# EasyEDA schematic Sheet_1.json
TITLE: IoT Counter; REV: 1.0; Date: 2021-06-05; Sheet: 1/1; Drawn By: usman.ashraf678; Company: Manna and Chopra
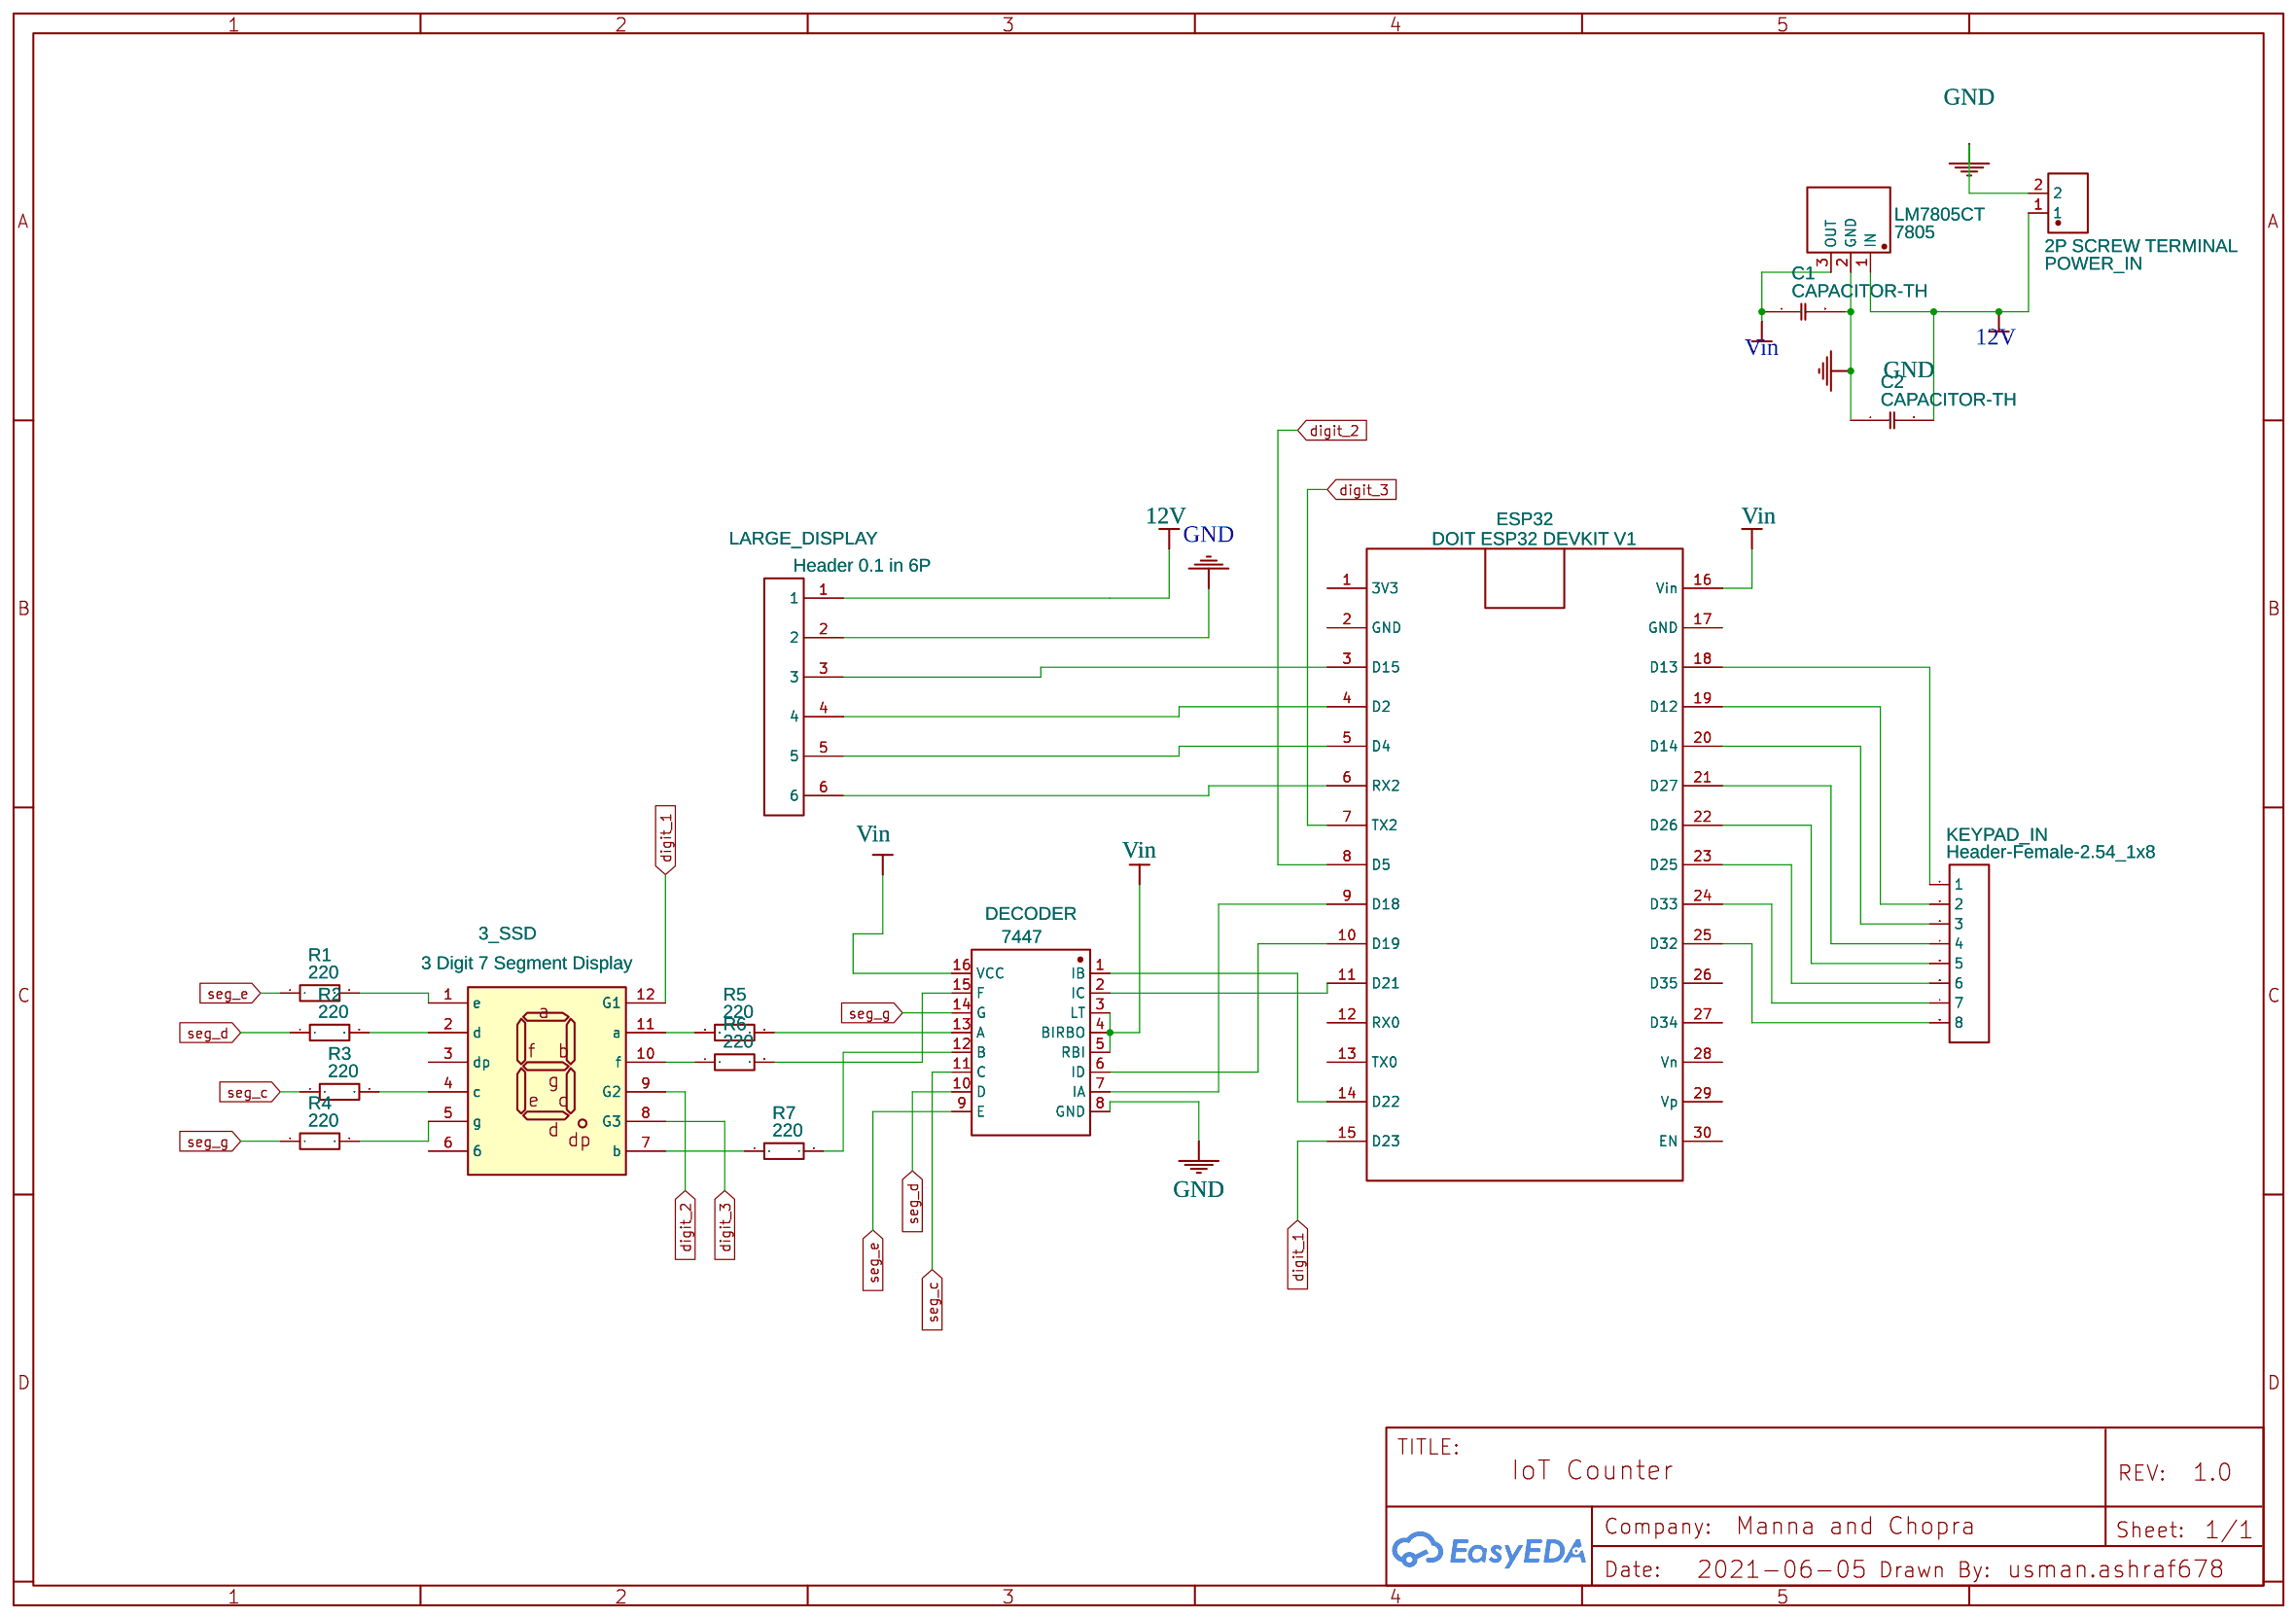
[diagram p0: schematic sheet]

## Parts
3_SSD  3 Digit 7 Segment Display  [3_DIGIT_7-SEGMENT_DISPLAY 0.56 INCHES]
7805  LM7805CT  [TO-220-3_L10.0-W4.5-P2.54-L]
C1  CAPACITOR-TH  [CAPACITOR-TH]
C2  CAPACITOR-TH  [CAPACITOR-TH]
DECODER  7447  [DIP16 THICK PADS]
ESP32  DOIT ESP32 DEVKIT V1  [DOIT_ESP32]
KEYPAD_IN  Header-Female-2.54_1x8  [HDR-TH_8P-P2.54-V]
LARGE_DISPLAY  Header 0.1 in 6P  [6P HEADER 5.08MM]
POWER_IN  2P SCREW TERMINAL  [2P SCREW TERMINAL]
R1  220  [RES TH LONG WIRE]
R2  220  [RES TH LONG WIRE]
R3  220  [RES TH LONG WIRE]
R4  220  [RES TH LONG WIRE]
R5  220  [RES TH LONG WIRE]
R6  220  [RES TH LONG WIRE]
R7  220  [RES TH LONG WIRE]

## Library data of the parts
3_SSD = 3 Digit 7 Segment Display: Contributor: Tecsa
7805 = LM7805CT: Supplier: LCSC; Manufacturer: FAIRCHILD; Supplier Part: C22146
C1 C2 = CAPACITOR-TH: Contributor: hctan22
DECODER = 7447: sourceId: zTe82I0UA
ESP32 = DOIT ESP32 DEVKIT V1: Contributor: ณัฏฐพล พงศ์ไพบูลย์วิริยะ
KEYPAD_IN = Header-Female-2.54_1x8: Supplier: LCSC; Manufacturer: BOOMELE; Manufacturer Part: Female headerHDR1X8-2.54; Supplier Part: C27438; JLCPCB Part Class: Extended Part
LARGE_DISPLAY = Header 5mm 6P: Manufacturer Part: xx; Contributor: momotica
POWER_IN = 2P SCREW TERMINAL: Contributor: teptical1
R1-R7 = MF1/8W ±1% 220Ω STB5: Supplier: LCSC; Supplier Part: C337135; Manufacturer: FlyWin; Contributor: LCSC; JLCPCB Part Class: Extended Part

## Nets
12V: 7805.1(IN) C2.2 LARGE_DISPLAY.1 POWER_IN.1
GND: 7805.2(GND) C1.2 C2.1 DECODER.8(GND) LARGE_DISPLAY.2 POWER_IN.2
Vin: 7805.3(OUT) C1.1 DECODER.3(LT) DECODER.4(BIRBO) DECODER.5(RBI) DECODER.16(VCC) ESP32.16(Vin)
digit_1: 3_SSD.12(G1) ESP32.15(D23)
digit_2: 3_SSD.9(G2) ESP32.8(D5)
digit_3: 3_SSD.8(G3) ESP32.7(TX2)
seg_c: DECODER.11(C) R3.1
seg_d: DECODER.10(D) R2.1
seg_e: DECODER.9(E) R1.1
seg_g: DECODER.14(G) R4.1
Net-(3_SSD-1): 3_SSD.1(e) R1.2
Net-(3_SSD-2): 3_SSD.2(d) R2.2
Net-(3_SSD-4): 3_SSD.4(c) R3.2
Net-(3_SSD-5): 3_SSD.5(g) R4.2
Net-(3_SSD-7): 3_SSD.7(b) R7.1
Net-(3_SSD-10): 3_SSD.10(f) R6.1
Net-(3_SSD-11): 3_SSD.11(a) R5.1
Net-(DECODER-1): DECODER.1(IB) ESP32.14(D22)
Net-(DECODER-2): DECODER.2(IC) ESP32.11(D21)
Net-(DECODER-6): DECODER.6(ID) ESP32.10(D19)
Net-(DECODER-7): DECODER.7(IA) ESP32.9(D18)
Net-(DECODER-12): DECODER.12(B) R7.2
Net-(DECODER-13): DECODER.13(A) R5.2
Net-(DECODER-15): DECODER.15(F) R6.2
Net-(ESP32-3): ESP32.3(D15) LARGE_DISPLAY.3
Net-(ESP32-4): ESP32.4(D2) LARGE_DISPLAY.4
Net-(ESP32-5): ESP32.5(D4) LARGE_DISPLAY.5
Net-(ESP32-6): ESP32.6(RX2) LARGE_DISPLAY.6
Net-(ESP32-18): ESP32.18(D13) KEYPAD_IN.1
Net-(ESP32-19): ESP32.19(D12) KEYPAD_IN.2
Net-(ESP32-20): ESP32.20(D14) KEYPAD_IN.3
Net-(ESP32-21): ESP32.21(D27) KEYPAD_IN.4
Net-(ESP32-22): ESP32.22(D26) KEYPAD_IN.5
Net-(ESP32-23): ESP32.23(D25) KEYPAD_IN.6
Net-(ESP32-24): ESP32.24(D33) KEYPAD_IN.7
Net-(ESP32-25): ESP32.25(D32) KEYPAD_IN.8

Not connected (* = marked no-connect by the designer): 3_SSD 3(dp) 6; ESP32 1(3V3) 2(GND) 12(RX0) 13(TX0) 17(GND) 26(D35) 27(D34) 28(Vn) 29(Vp) 30(EN)
